# EAGLE schematic Atmega (EAGLE 6.2)
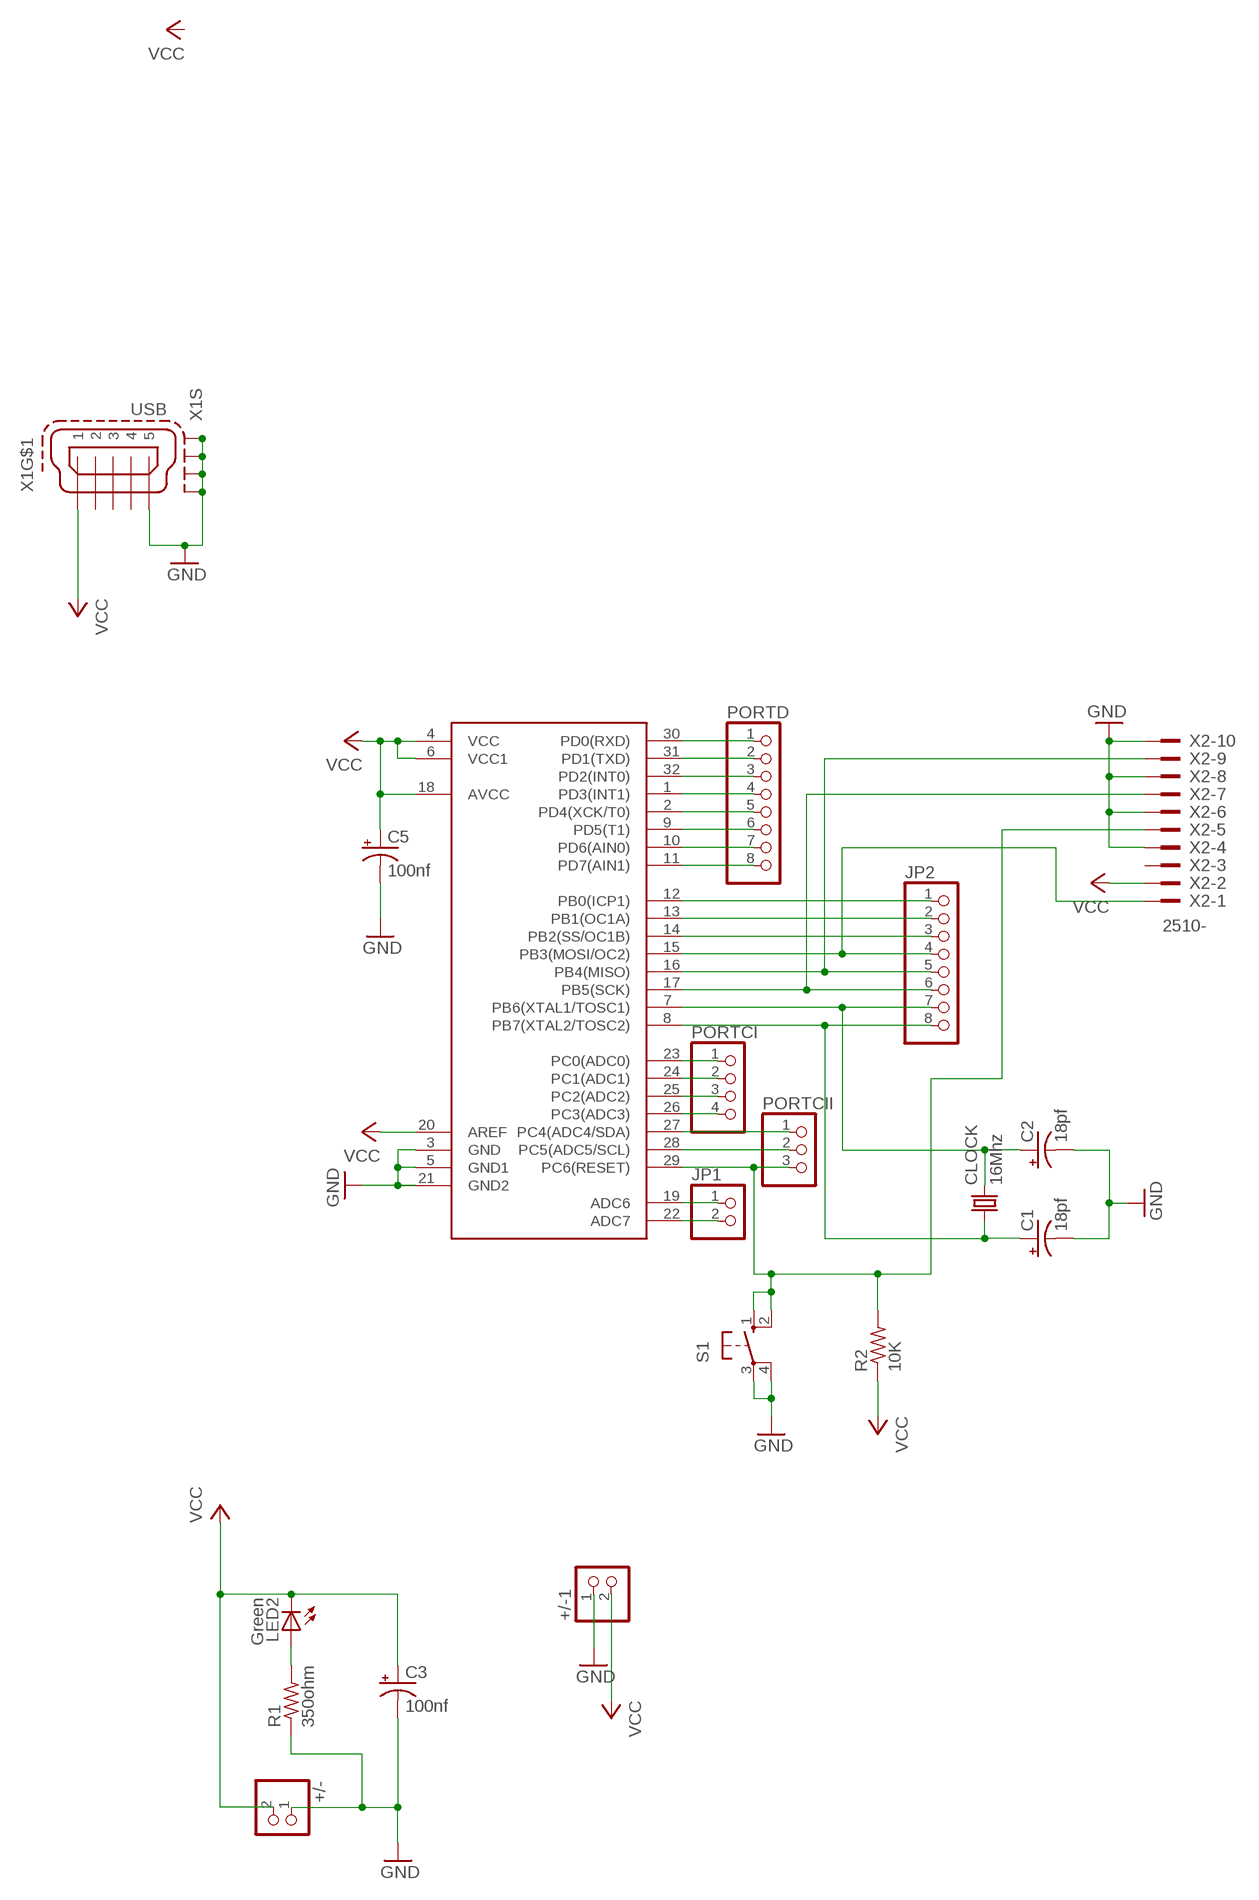
[diagram p0: schematic, sheet 1]

## Parts
+/-  PINHD-1X2  [1X02]
+/-1  PINHD-1X2  [1X02]
C1  18pf  CPOL-USSMCZ  [SMC_Z]
C2  18pf  CPOL-USSMCZ  [SMC_Z]
C3  100nf  CPOL-USSMCZ  [SMC_Z]
C5  100nf  CPOL-USSMCZ  [SMC_Z]
CLOCK  16Mhz  CRYSTALHC49UP  [HC49UP]
JP1  PINHD-1X2  [1X02]
JP2  PINHD-1X8  [1X08]
LED2  Green  LG_T679-E1F1-1  [PLCC2]
PORTCI  PINHD-1X4  [1X04]
PORTCII  PINHD-1X3  [1X03]
PORTD  PINHD-1X8  [1X08]
R1  350ohm  R-US_M0805  [M0805]
R2  10K  R-US_M0805  [M0805]
S1  10-XX  [B3F-10XX]
U$1  ATMEGA8A  [TQFP32-08]
X1  USB  MINI-USB-SCHIELD-32005-201  [32005-201]
X2  2510-  [PAK100/2500-10]

## Nets
GND: +/-1.1 +/-.1 C1.- C2.- C3.- C5.- R1.1 S1.3(P) S1.4(P1) U$1.3(GND) U$1.5(GND1) U$1.21(GND2) X1.5 X1.M1(S:S1) X1.M2(S:S2) X1.M3(S:S3) X1.M4(S:S4) X2.4 X2.6 X2.8 X2.10
N$4: LED2.A R1.2
N$5: PORTCI.1 U$1.23(PC0(ADC0))
N$6: PORTCI.2 U$1.24(PC1(ADC1))
N$8: PORTCI.3 U$1.25(PC2(ADC2))
N$9: PORTCI.4 U$1.26(PC3(ADC3))
N$10: PORTCII.1 U$1.27(PC4(ADC4/SDA))
N$11: PORTCII.2 U$1.28(PC5(ADC5/SCL))
N$12: PORTCII.3 R2.2 S1.1(S) S1.2(S1) U$1.29(PC6(RESET)) X2.5
N$13: JP2.1 U$1.12(PB0(ICP1))
N$14: JP2.2 U$1.13(PB1(OC1A))
N$15: JP2.3 U$1.14(PB2(SS/OC1B))
N$16: JP2.4 U$1.15(PB3(MOSI/OC2)) X2.1
N$17: JP2.5 U$1.16(PB4(MISO)) X2.9
N$18: JP2.6 U$1.17(PB5(SCK)) X2.7
N$19: C2.+ CLOCK.2 JP2.7 U$1.7(PB6(XTAL1/TOSC1))
N$20: C1.+ CLOCK.1 JP2.8 U$1.8(PB7(XTAL2/TOSC2))
N$22: PORTD.1 U$1.30(PD0(RXD))
N$23: PORTD.2 U$1.31(PD1(TXD))
N$25: PORTD.3 U$1.32(PD2(INT0))
N$26: PORTD.4 U$1.1(PD3(INT1))
N$27: PORTD.5 U$1.2(PD4(XCK/T0))
N$29: PORTD.6 U$1.9(PD5(T1))
N$30: PORTD.7 U$1.10(PD6(AIN0))
N$31: PORTD.8 U$1.11(PD7(AIN1))
N$32: JP1.1 U$1.19(ADC6)
N$33: JP1.2 U$1.22(ADC7)
VCC: +/-1.2 +/-.2 C3.+ C5.+ LED2.C R2.1 U$1.4(VCC) U$1.6(VCC1) U$1.18(AVCC) U$1.20(AREF) X1.1 X2.2
Unconnected: X1.2 X1.3 X1.4 X2.3

## Library data of the parts
+/- +/-1 JP1 = pinhead:PINHD-1X2: PIN HEADER
C1-C3 C5 = rcl:CPOL-US: POLARIZED CAPACITOR, American symbol
CLOCK = crystal:CRYSTAL: CRYSTAL; OC_FARNELL: unknown; OC_NEWARK: unknown
JP2 PORTD = pinhead:PINHD-1X8: PIN HEADER
LED2 = led:*_T679-?-1: LC TOPLED® Low Current LED Source: http://catalog.osram-os.com .. LG_LS_LY_T679_OBS.pdf; COLOR: green
PORTCI = pinhead:PINHD-1X4: PIN HEADER
PORTCII = pinhead:PINHD-1X3: PIN HEADER
R1 R2 = rcl:R-US_: RESISTOR, American symbol
S1 = switch-omron:10-XX: OMRON SWITCH; MPN: B3F-1000; OC_FARNELL: 176432; OC_NEWARK: 36M3542
U$1 = atmel:ATMEGA8A
X1 = con-cypressindustries:MINI-USB-SCHIELD-: MINI USB-B Conector Source: www.cypressindustries.com; OC_FARNELL: unknown; OC_NEWARK: unknown
X2 = con-3m:2510-: 3M (TM) Pak 100 4-Wall Header Source: 3M; MF: 3M; MPN: 2510-6002UB; OC_FARNELL: 9838244; OC_NEWARK: 46F4725